# Altium schematic sheet 19 PCIE BRIDGE.SchDoc
size 594 x 420 mm
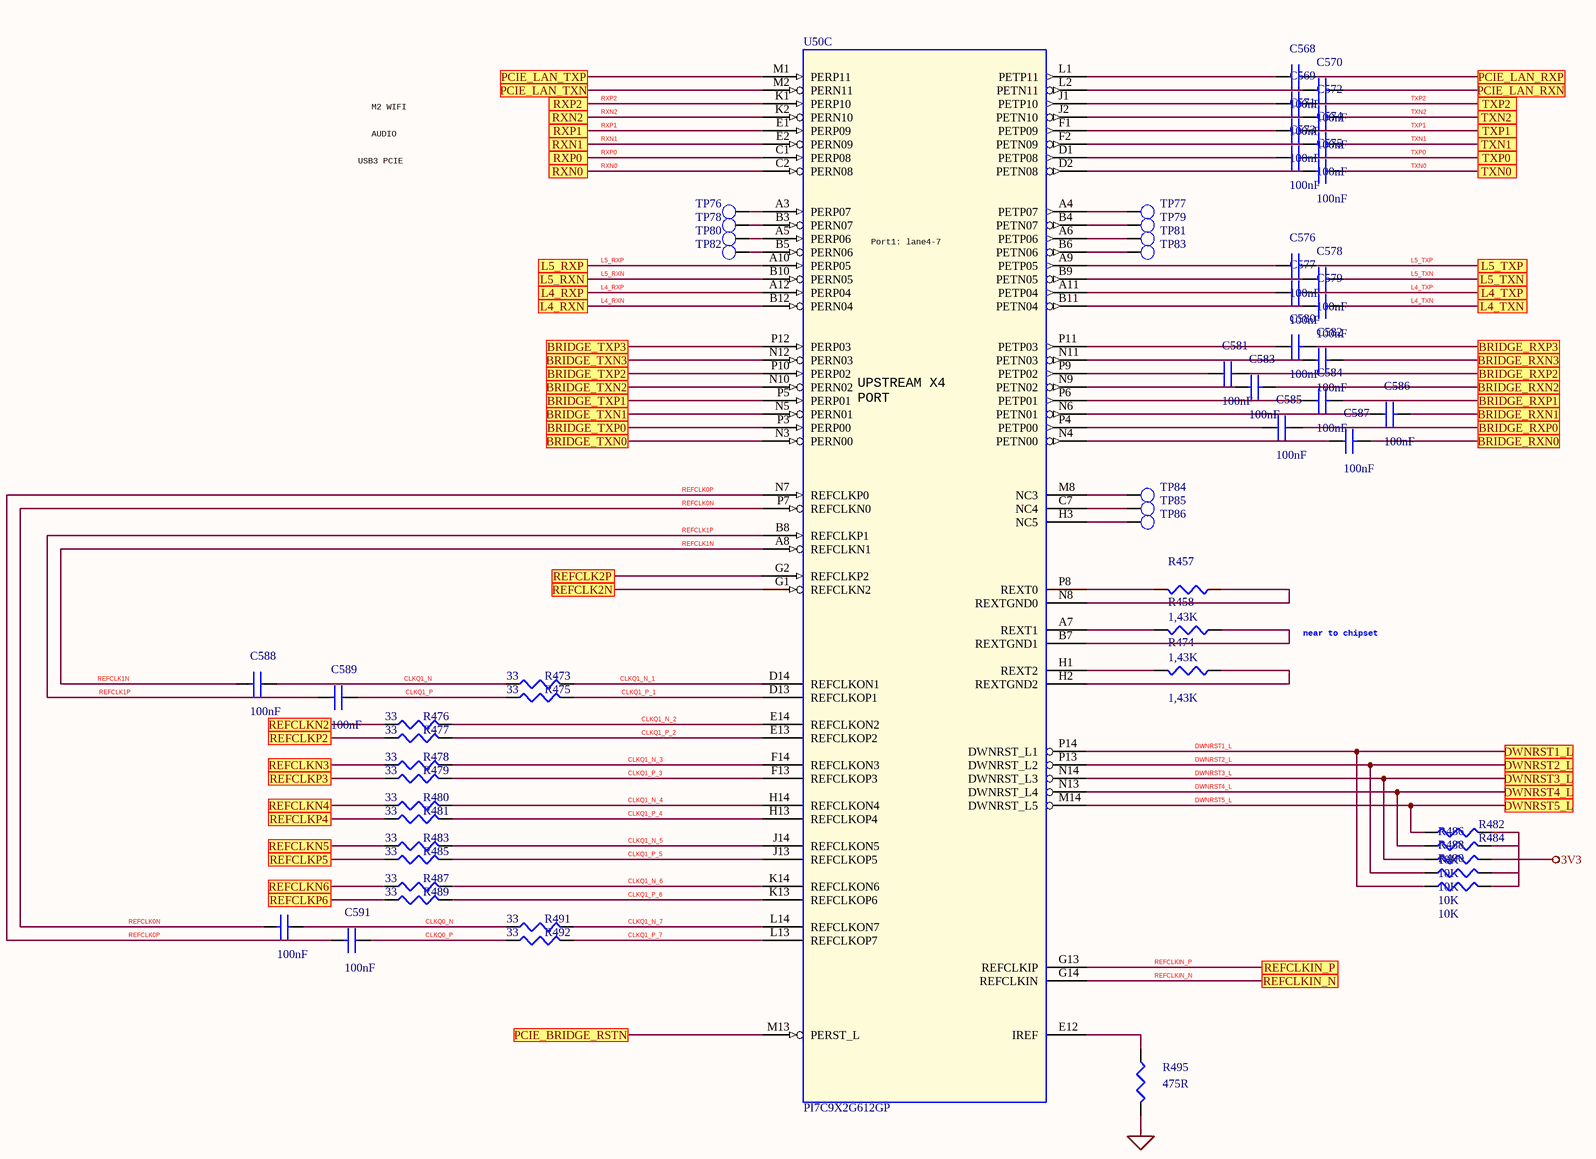
[diagram p0: 19 PCIE BRIDGE.SchDoc, top left]
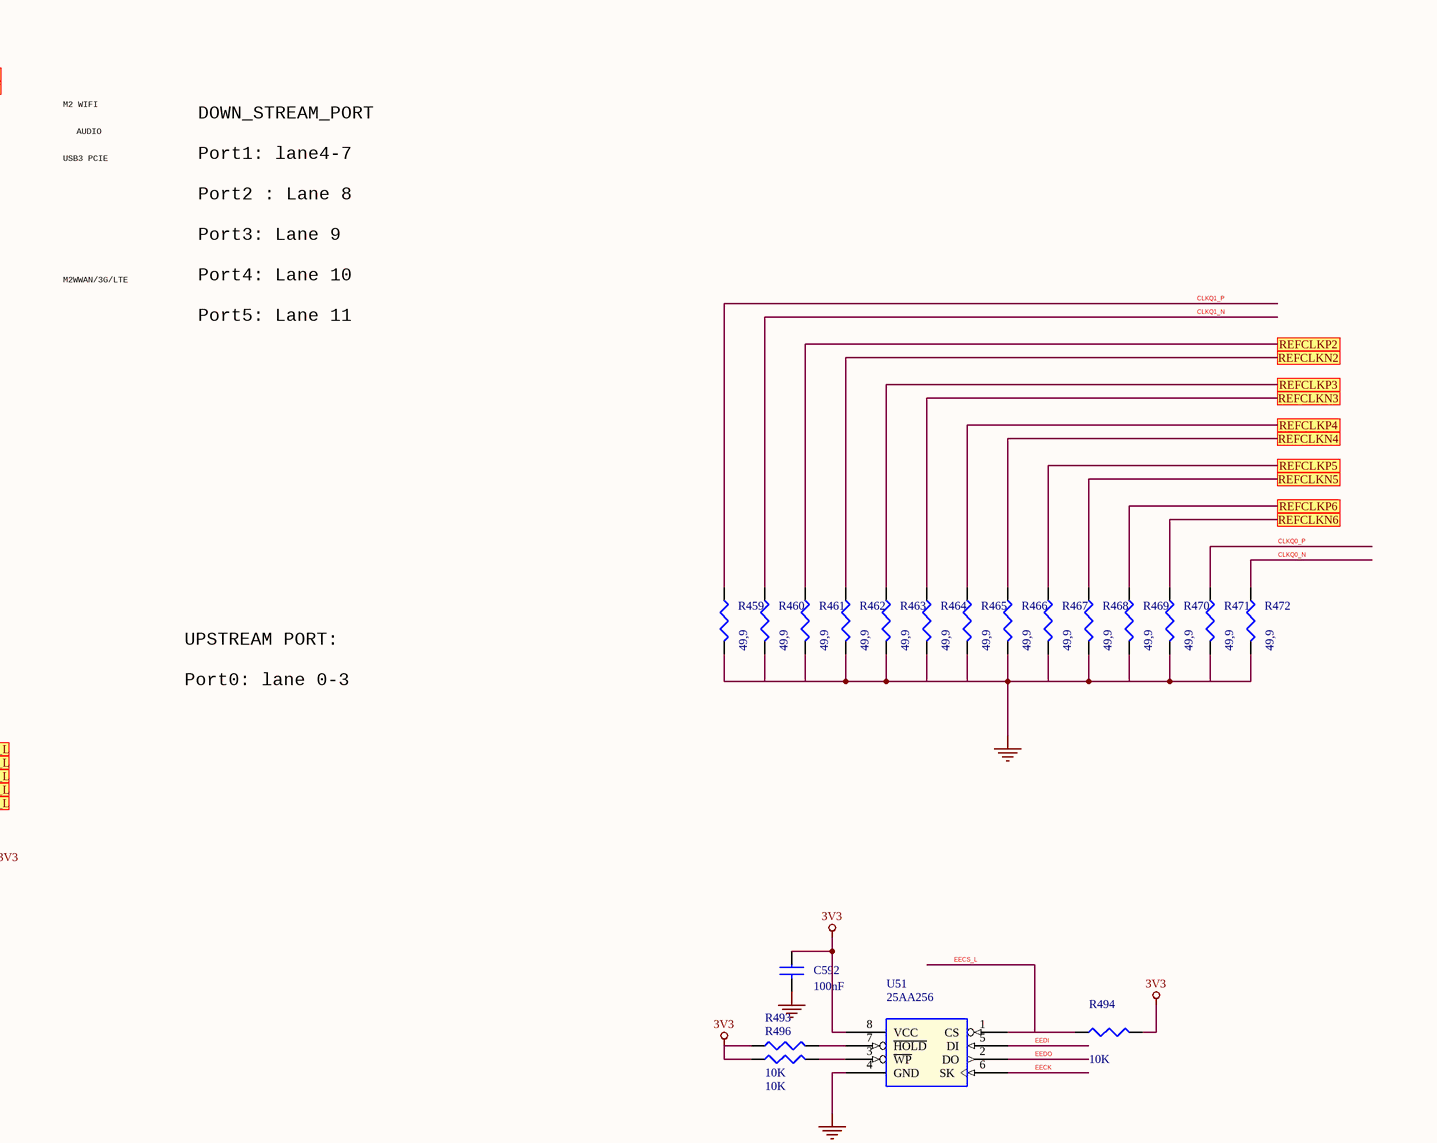
[diagram p1: 19 PCIE BRIDGE.SchDoc, top right]
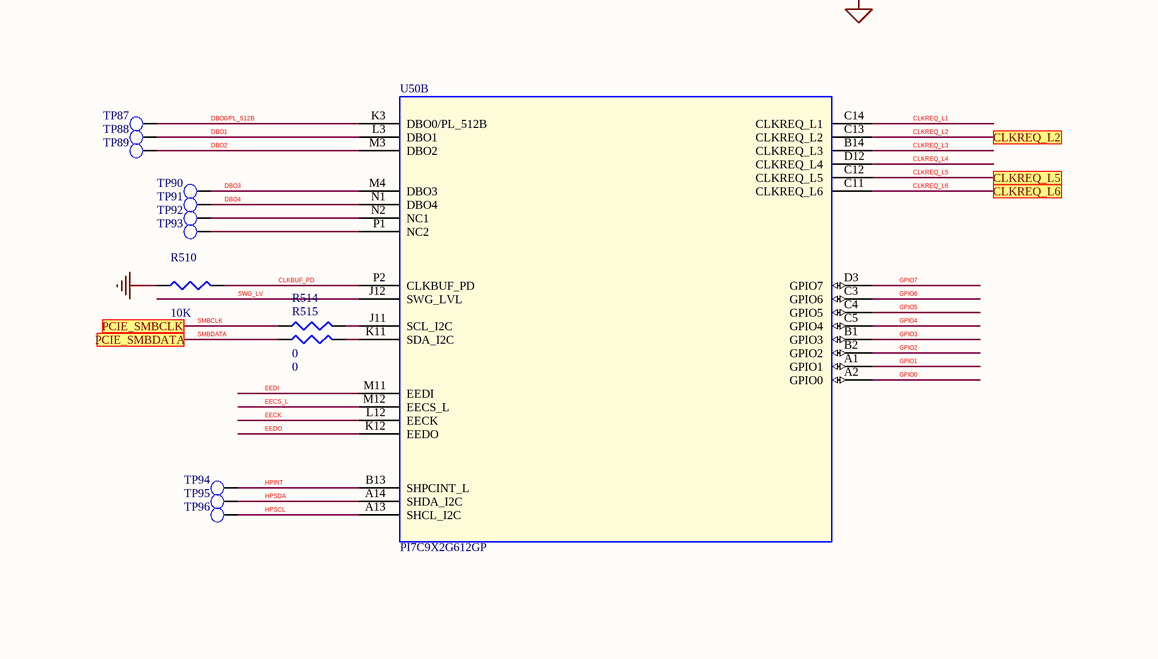
[diagram p2: 19 PCIE BRIDGE.SchDoc, bottom left]
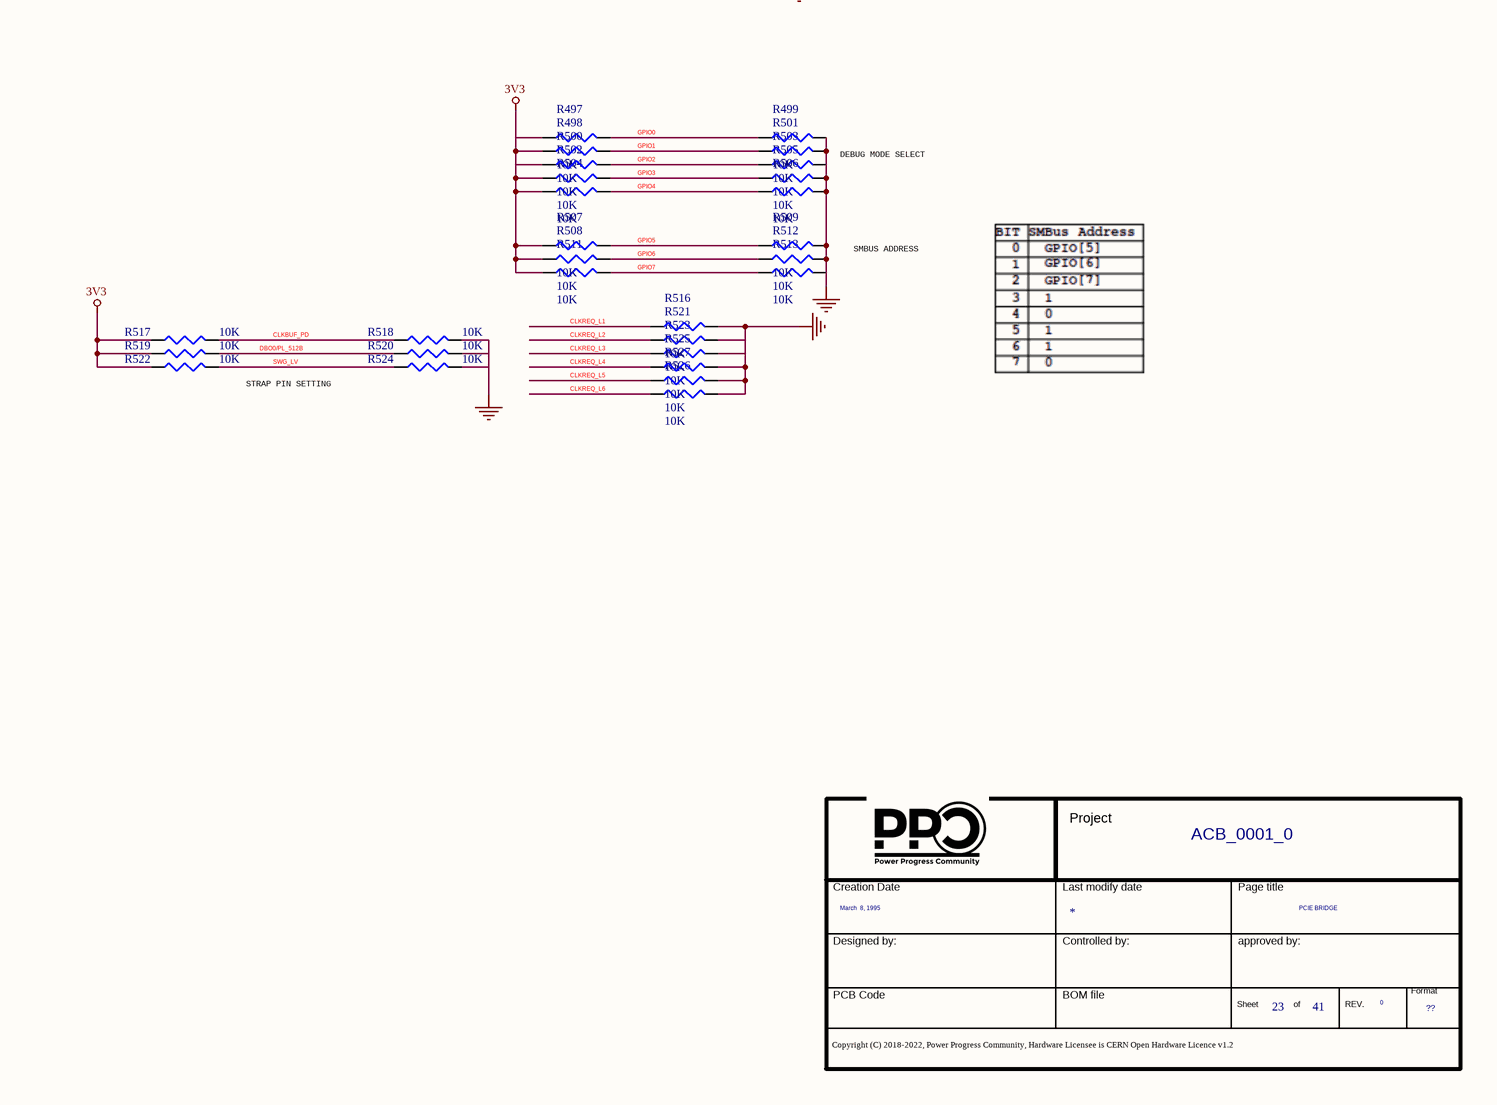
[diagram p3: 19 PCIE BRIDGE.SchDoc, bottom right]

## Parts
*  Page Count: 41  Page Create Date: March  8, 1995  Page Number: 23  Page Size: ??  Page Title: PCIE BRIDGE  RevCode: 0  Title: ACB_0001_0  (hidden comment: Title_block_PPC)  (graphical)
C568  100nF  [SMD_0402]
C569  100nF  [SMD_0402]
C570  100nF  [SMD_0402]
C571  100nF  [SMD_0402]
C572  100nF  [SMD_0402]
C573  100nF  [SMD_0402]
C574  100nF  [SMD_0402]
C575  100nF  [SMD_0402]
C576  100nF  [SMD_0402]
C577  100nF  [SMD_0402]
C578  100nF  [SMD_0402]
C579  100nF  [SMD_0402]
C580  100nF  [SMD_0201]
C581  100nF  [SMD_0201]
C582  100nF  [SMD_0201]
C583  100nF  [SMD_0201]
C584  100nF  [SMD_0201]
C585  100nF  [SMD_0201]
C586  100nF  [SMD_0201]
C587  100nF  [SMD_0201]
C588  100nF  [SMD_0603]
C589  100nF  [SMD_0603]
C590  100nF  [SMD_0402]
C591  100nF  [SMD_0402]
C592  100nF  [SMD_0201]
R457  1,43K  [SMD_0402]
R458  1,43K  [SMD_0402]
R459  49,9  [SMD_0402]
R460  49,9  [SMD_0402]
R461  49,9  [SMD_0402]
R462  49,9  [SMD_0402]
R463  49,9  [SMD_0402]
R464  49,9  [SMD_0402]
R465  49,9  [SMD_0402]
R466  49,9  [SMD_0402]
R467  49,9  [SMD_0402]
R468  49,9  [SMD_0402]
R469  49,9  [SMD_0402]
R470  49,9  [SMD_0402]
R471  49,9  [SMD_0402]
R472  49,9  [SMD_0402]
R473  33  [SMD_0402]
R474  1,43K  [SMD_0402]
R475  33  [SMD_0402]
R476  33  [SMD_0402]
R477  33  [SMD_0402]
R478  33  [SMD_0402]
R479  33  [SMD_0402]
R480  33  [SMD_0402]
R481  33  [SMD_0402]
R482  10K  [SMD_0402]
R483  33  [SMD_0402]
R484  10K  [SMD_0402]
R485  33  [SMD_0402]
R486  10K  [SMD_0402]
R487  33  [SMD_0402]
R488  10K  [SMD_0402]
R489  33  [SMD_0402]
R490  10K  [SMD_0402]
R491  33  [SMD_0402]
R492  33  [SMD_0402]
R493  10K  [SMD_0402]
R494  10K  [SMD_0402]
R495  475R  [SMD_0402]
R496  10K  [SMD_0402]
R497  10K  [SMD_0402]
R498  10K  [SMD_0402]
R499  10K  [SMD_0402]
R500  10K  [SMD_0402]
R501  10K  [SMD_0402]
R502  10K  [SMD_0402]
R503  10K  [SMD_0402]
R504  10K  [SMD_0402]
R505  10K  [SMD_0402]
R506  10K  [SMD_0402]
R507  10K  [SMD_0402]
R508  10K  [SMD_0402]
R509  10K  [SMD_0402]
R510  10K  [SMD_0402]
R511  10K  [SMD_0402]
R512  10K  [SMD_0402]
R513  10K  [SMD_0402]
R514  0  [SMD_0402]
R515  0  [SMD_0402]
R516  10K  [SMD_0402]
R517  10K  [SMD_0402]
R518  10K  [SMD_0402]
R519  10K  [SMD_0402]
R520  10K  [SMD_0402]
R521  10K  [SMD_0402]
R522  10K  [SMD_0402]
R523  10K  [SMD_0402]
R524  10K  [SMD_0402]
R525  10K  [SMD_0402]
R526  10K  [SMD_0402]
R527  10K  [SMD_0402]
TP76  TEST POINT  [PCB]  (value not drawn)
TP77  TEST POINT  [PCB]  (value not drawn)
TP78  TEST POINT  [PCB]  (value not drawn)
TP79  TEST POINT  [PCB]  (value not drawn)
TP80  TEST POINT  [PCB]  (value not drawn)
TP81  TEST POINT  [PCB]  (value not drawn)
TP82  TEST POINT  [PCB]  (value not drawn)
TP83  TEST POINT  [PCB]  (value not drawn)
TP84  TEST POINT  [PCB]  (value not drawn)
TP85  TEST POINT  [PCB]  (value not drawn)
TP86  TEST POINT  [PCB]  (value not drawn)
TP87  TEST POINT  [PCB]  (value not drawn)
TP88  TEST POINT  [PCB]  (value not drawn)
TP89  TEST POINT  [PCB]  (value not drawn)
TP90  TEST POINT  [PCB]  (value not drawn)
TP91  TEST POINT  [PCB]  (value not drawn)
TP92  TEST POINT  [PCB]  (value not drawn)
TP93  TEST POINT  [PCB]  (value not drawn)
TP94  TEST POINT  [PCB]  (value not drawn)
TP95  TEST POINT  [PCB]  (value not drawn)
TP96  TEST POINT  [PCB]  (value not drawn)
U50  PI7C9X2G612GP  [LQFP]  (parts B,C of 3)
U51  25AA256  [SOIC8]

## Ports
BRIDGE_RXN0, BRIDGE_RXN1, BRIDGE_RXN2, BRIDGE_RXN3, BRIDGE_RXP0, BRIDGE_RXP1, BRIDGE_RXP2, BRIDGE_RXP3, BRIDGE_TXN0, BRIDGE_TXN1, BRIDGE_TXN2, BRIDGE_TXN3, BRIDGE_TXP0, BRIDGE_TXP1, BRIDGE_TXP2, BRIDGE_TXP3, CLKREQ_L2, CLKREQ_L5, CLKREQ_L6, DWNRST1_L, DWNRST2_L, DWNRST3_L, DWNRST4_L, DWNRST5_L, L4_RXN, L4_RXP, L4_TXN, L4_TXP, L5_RXN, L5_RXP, L5_TXN, L5_TXP, PCIE_BRIDGE_RSTN, PCIE_LAN_RXN, PCIE_LAN_RXP, PCIE_LAN_TXN, PCIE_LAN_TXP, PCIE_SMBCLK, PCIE_SMBDATA, REFCLK2N, REFCLK2P, REFCLKIN_N, REFCLKIN_P, REFCLKN2, REFCLKN3, REFCLKN4, REFCLKN5, REFCLKN6, REFCLKP2, REFCLKP3, REFCLKP4, REFCLKP5, REFCLKP6, RXN0, RXN1, RXN2, RXP0, RXP1, RXP2, TXN0, TXN1, TXN2, TXP0, TXP1, TXP2

## Nets
3V3: C592.1 R482.2 R484.2 R486.2 R488.2 R490.2 R493.1 R494.2 R496.1 R497.1 R498.1 R500.1 R502.1 R504.1 R507.1 R508.1 R511.1 R517.1 R519.1 R522.1 U51.8(VCC)
GND: C592.2 R459.2 R460.2 R461.2 R462.2 R463.2 R464.2 R465.2 R466.2 R467.2 R468.2 R469.2 R470.2 R471.2 R472.2 R495.2 R499.2 R501.2 R503.2 R505.2 R506.2 R509.2 R510.2 R512.2 R513.2 R516.2 R518.2 R520.2 R521.2 R523.2 R524.2 R525.2 R526.2 R527.2 U51.4(GND)
BRIDGE_RXN0: C587.2 ; port BRIDGE_RXN0
BRIDGE_RXN1: C586.2 ; port BRIDGE_RXN1
BRIDGE_RXN2: C583.2 ; port BRIDGE_RXN2
BRIDGE_RXN3: C582.2 ; port BRIDGE_RXN3
BRIDGE_RXP0: C585.2 ; port BRIDGE_RXP0
BRIDGE_RXP1: C584.2 ; port BRIDGE_RXP1
BRIDGE_RXP2: C581.2 ; port BRIDGE_RXP2
BRIDGE_RXP3: C580.2 ; port BRIDGE_RXP3
BRIDGE_TXN0: U50.N3(PERN00) ; port BRIDGE_TXN0
BRIDGE_TXN1: U50.N5(PERN01) ; port BRIDGE_TXN1
BRIDGE_TXN2: U50.N10(PERN02) ; port BRIDGE_TXN2
BRIDGE_TXN3: U50.N12(PERN03) ; port BRIDGE_TXN3
BRIDGE_TXP0: U50.P3(PERP00) ; port BRIDGE_TXP0
BRIDGE_TXP1: U50.P5(PERP01) ; port BRIDGE_TXP1
BRIDGE_TXP2: U50.P10(PERP02) ; port BRIDGE_TXP2
BRIDGE_TXP3: U50.P12(PERP03) ; port BRIDGE_TXP3
CLKBUF_PD: R510.1 R517.2 R518.1 U50.P2(CLKBUF_PD)
CLKQ0_N: C590.1 R472.1 R491.2
CLKQ0_P: C591.1 R471.1 R492.2
CLKQ1_N: C588.1 R460.1 R473.2
CLKQ1_N_1: R473.1 U50.D14(REFCLKON1)
CLKQ1_N_2: R476.1 U50.E14(REFCLKON2)
CLKQ1_N_3: R478.1 U50.F14(REFCLKON3)
CLKQ1_N_4: R480.1 U50.H14(REFCLKON4)
CLKQ1_N_5: R483.1 U50.J14(REFCLKON5)
CLKQ1_N_6: R487.1 U50.K14(REFCLKON6)
CLKQ1_N_7: R491.1 U50.L14(REFCLKON7)
CLKQ1_P: C589.1 R459.1 R475.2
CLKQ1_P_1: R475.1 U50.D13(REFCLKOP1)
CLKQ1_P_2: R477.1 U50.E13(REFCLKOP2)
CLKQ1_P_3: R479.1 U50.F13(REFCLKOP3)
CLKQ1_P_4: R481.1 U50.H13(REFCLKOP4)
CLKQ1_P_5: R485.1 U50.J13(REFCLKOP5)
CLKQ1_P_6: R489.1 U50.K13(REFCLKOP6)
CLKQ1_P_7: R492.1 U50.L13(REFCLKOP7)
CLKREQ_L1: R516.1 U50.C14(CLKREQ_L1)
CLKREQ_L2: R521.1 U50.C13(CLKREQ_L2) ; port CLKREQ_L2
CLKREQ_L3: R523.1 U50.B14(CLKREQ_L3)
CLKREQ_L4: R525.1 U50.D12(CLKREQ_L4)
CLKREQ_L5: R527.1 U50.C12(CLKREQ_L5) ; port CLKREQ_L5
CLKREQ_L6: R526.1 U50.C11(CLKREQ_L6) ; port CLKREQ_L6
DBO0/PL_512B: R519.2 R520.1 TP87.1(TP) U50.K3(DBO0/PL_512B)
DBO1: TP88.1(TP) U50.L3(DBO1)
DBO2: TP89.1(TP) U50.M3(DBO2)
DBO3: TP90.1(TP) U50.M4(DBO3)
DBO4: TP91.1(TP) U50.N1(DBO4)
DWNRST1_L: R490.1 U50.P14(DWNRST_L1) ; port DWNRST1_L
DWNRST2_L: R488.1 U50.P13(DWNRST_L2) ; port DWNRST2_L
DWNRST3_L: R486.1 U50.N14(DWNRST_L3) ; port DWNRST3_L
DWNRST4_L: R484.1 U50.N13(DWNRST_L4) ; port DWNRST4_L
DWNRST5_L: R482.1 U50.M14(DWNRST_L5) ; port DWNRST5_L
EECK: U50.L12(EECK) U51.6(SK)
EECS_L: R494.1 U50.M12(EECS_L) U51.1(CS)
EEDI: U50.M11(EEDI) U51.5(DI)
EEDO: U50.K12(EEDO) U51.2(DO)
GPIO0: R497.2 R499.1 U50.A2(GPIO0)
GPIO1: R498.2 R501.1 U50.A1(GPIO1)
GPIO2: R500.2 R503.1 U50.B2(GPIO2)
GPIO3: R502.2 R505.1 U50.B1(GPIO3)
GPIO4: R504.2 R506.1 U50.C5(GPIO4)
GPIO5: R507.2 R509.1 U50.C4(GPIO5)
GPIO6: R508.2 R512.1 U50.C3(GPIO6)
GPIO7: R511.2 R513.1 U50.D3(GPIO7)
HPINT: TP94.1(TP) U50.B13(SHPCINT_L)
HPSCL: TP96.1(TP) U50.A13(SHCL_I2C)
HPSDA: TP95.1(TP) U50.A14(SHDA_I2C)
L4_RXN: U50.B12(PERN04) ; port L4_RXN
L4_RXP: U50.A12(PERP04) ; port L4_RXP
L4_TXN: C579.2 ; port L4_TXN
L4_TXP: C577.2 ; port L4_TXP
L5_RXN: U50.B10(PERN05) ; port L5_RXN
L5_RXP: U50.A10(PERP05) ; port L5_RXP
L5_TXN: C578.2 ; port L5_TXN
L5_TXP: C576.2 ; port L5_TXP
PCIE_BRIDGE_RSTN: U50.M13(PERST_L) ; port PCIE_BRIDGE_RSTN
PCIE_LAN_RXN: C570.2 ; port PCIE_LAN_RXN
PCIE_LAN_RXP: C568.2 ; port PCIE_LAN_RXP
PCIE_LAN_TXN: U50.M2(PERN11) ; port PCIE_LAN_TXN
PCIE_LAN_TXP: U50.M1(PERP11) ; port PCIE_LAN_TXP
REFCLK0N: C590.2 U50.P7(REFCLKN0)
REFCLK0P: C591.2 U50.N7(REFCLKP0)
REFCLK1N: C588.2 U50.A8(REFCLKN1)
REFCLK1P: C589.2 U50.B8(REFCLKP1)
REFCLK2N: U50.G1(REFCLKN2) ; port REFCLK2N
REFCLK2P: U50.G2(REFCLKP2) ; port REFCLK2P
REFCLKIN_N: U50.G14(REFCLKIN) ; port REFCLKIN_N
REFCLKIN_P: U50.G13(REFCLKIP) ; port REFCLKIN_P
REFCLKN2: R462.1 R476.2 ; port REFCLKN2
REFCLKN3: R464.1 R478.2 ; port REFCLKN3
REFCLKN4: R466.1 R480.2 ; port REFCLKN4
REFCLKN5: R468.1 R483.2 ; port REFCLKN5
REFCLKN6: R470.1 R487.2 ; port REFCLKN6
REFCLKP2: R461.1 R477.2 ; port REFCLKP2
REFCLKP3: R463.1 R479.2 ; port REFCLKP3
REFCLKP4: R465.1 R481.2 ; port REFCLKP4
REFCLKP5: R467.1 R485.2 ; port REFCLKP5
REFCLKP6: R469.1 R489.2 ; port REFCLKP6
RXN0: U50.C2(PERN08) ; port RXN0
RXN1: U50.E2(PERN09) ; port RXN1
RXN2: U50.K2(PERN10) ; port RXN2
RXP0: U50.C1(PERP08) ; port RXP0
RXP1: U50.E1(PERP09) ; port RXP1
RXP2: U50.K1(PERP10) ; port RXP2
SMBCLK: R514.1 ; port PCIE_SMBCLK
SMBDATA: R515.1 ; port PCIE_SMBDATA
SWG_LV: R522.2 R524.1 U50.J12(SWG_LVL)
TXN0: C575.2 ; port TXN0
TXN1: C574.2 ; port TXN1
TXN2: C572.2 ; port TXN2
TXP0: C573.2 ; port TXP0
TXP1: C571.2 ; port TXP1
TXP2: C569.2 ; port TXP2
NetC568_1: C568.1 U50.L1(PETP11)
NetC569_1: C569.1 U50.J1(PETP10)
NetC570_1: C570.1 U50.L2(PETN11)
NetC571_1: C571.1 U50.F1(PETP09)
NetC572_1: C572.1 U50.J2(PETN10)
NetC573_1: C573.1 U50.D1(PETP08)
NetC574_1: C574.1 U50.F2(PETN09)
NetC575_1: C575.1 U50.D2(PETN08)
NetC576_1: C576.1 U50.A9(PETP05)
NetC577_1: C577.1 U50.A11(PETP04)
NetC578_1: C578.1 U50.B9(PETN05)
NetC579_1: C579.1 U50.B11(PETN04)
NetC580_1: C580.1 U50.P11(PETP03)
NetC581_1: C581.1 U50.P9(PETP02)
NetC582_1: C582.1 U50.N11(PETN03)
NetC583_1: C583.1 U50.N9(PETN02)
NetC584_1: C584.1 U50.P6(PETP01)
NetC585_1: C585.1 U50.P4(PETP00)
NetC586_1: C586.1 U50.N6(PETN01)
NetC587_1: C587.1 U50.N4(PETN00)
NetR457_1: R457.1 U50.P8(REXT0)
NetR457_2: R457.2 U50.N8(REXTGND0)
NetR458_1: R458.1 U50.A7(REXT1)
NetR458_2: R458.2 U50.B7(REXTGND1)
NetR474_1: R474.1 U50.H1(REXT2)
NetR474_2: R474.2 U50.H2(REXTGND2)
NetR493_2: R493.2 U51.7(~{HOLD})
NetR495_1: R495.1 U50.E12(IREF)
NetR496_2: R496.2 U51.3(~{WP})
NetR514_2: R514.2 U50.J11(SCL_I2C)
NetR515_2: R515.2 U50.K11(SDA_I2C)
NetTP76_1: TP76.1(TP) U50.A3(PERP07)
NetTP77_1: TP77.1(TP) U50.A4(PETP07)
NetTP78_1: TP78.1(TP) U50.B3(PERN07)
NetTP79_1: TP79.1(TP) U50.B4(PETN07)
NetTP80_1: TP80.1(TP) U50.A5(PERP06)
NetTP81_1: TP81.1(TP) U50.A6(PETP06)
NetTP82_1: TP82.1(TP) U50.B5(PERN06)
NetTP83_1: TP83.1(TP) U50.B6(PETN06)
NetTP84_1: TP84.1(TP) U50.M8(NC3)
NetTP85_1: TP85.1(TP) U50.C7(NC4)
NetTP86_1: TP86.1(TP) U50.H3(NC5)
NetTP92_1: TP92.1(TP) U50.N2(NC1)
NetTP93_1: TP93.1(TP) U50.P1(NC2)

## Notes on the sheet
- AUDIO
- M2 WIFI
- DOWN_STREAM_PORT
  Port1: lane4-7
  Port2 : Lane 8
  Port3: Lane 9
  Port4: Lane 10
  Port5: Lane 11
- USB3 PCIE
- (near U50) Port1: lane4-7
- M2WWAN/3G/LTE
- (near U50) UPSTREAM X4
  PORT
- UPSTREAM PORT:
  Port0: lane 0-3
- near to chipset
- DEBUG MODE SELECT
- SMBUS ADDRESS
- STRAP PIN SETTING
- (in symbol Title_block_PPC) Project; Creation Date; Last modify date; Page title; Designed by:; Controlled by:; approved by:; Format; PCB Code; BOM file; Sheet; of; REV.; Copyright (C) 2018-2022, Power Progress Community, Hardware Licensee is CERN Open Hardware Licence v1.2

## Library data of the parts
C568-C579 = CAP NP_Dup3: COND.CER. 100NF 50V 0402 X7R SMD; Manufacturer Part Number 1: CGA2B3X7R1H104M050BD; Manufacturer 1: TDK; Part Number: PASSIVE_24; RSM: RC0402; PCB Footprint: SMD_0402; Part Type: Capacitors\Ceramic\SMD\0402
C580-C587 C592 = CAP NP_Dup3: CAP CER 0.1UF 6.3V 20% X5R 0201; Part Number: PASSIVE_3; Manufacturer 1: TDK; Manufacturer Part Number 1: C0603X5R0J104M030BC; RSM: RC0201; Part Type: Capacitors\Ceramic\SMD\0201; PCB Footprint: SMD_0201
C588 C589 = CAP NP_Dup3: COND.CER.100NF 50V 0603 X7R SMD; Part Number: PASSIVE_118; Manufacturer 1: PANASONIC; Manufacturer Part Number 1: ECJ1VB1H104K; RSM: RC0603; Part Type: Capacitors\Ceramic\SMD\0603; PCB Footprint: SMD_0603
C590 C591 = CAP NP_Dup3: COND.CER. 100NF 50V 0402 X7R SMD; Part Number: PASSIVE_24; Manufacturer 1: TDK; Manufacturer Part Number 1: CGA2B3X7R1H104M050BD; RSM: RC0402; Part Type: Capacitors\Ceramic\SMD\0402; PCB Footprint: SMD_0402
R457 R458 R474 = R_Dup6: RESIS.CHIP 1,43K 1% 0402 SMD; Part Number: PASSIVE_1462; Manufacturer 1: ROYAL OHM; RSM: RC0402; Part Type: Resistors\Fixed\SMD\0402\1%; PCB Footprint: SMD_0402; Manufacturer Part Number 1: RESIS.CHIP 1,43K 1% 0402 SMD
R459-R470 = R_Dup6: RESIS.CHIP 49,9R 1% 0402 SMD; Part Number: PASSIVE_738; Manufacturer 1: NIC; Manufacturer Part Number 1: NCR04F49R9TRF; RSM: RC0402; PCB Footprint: SMD_0402; Part Type: Resistors\Fixed\SMD\0402\1%; Distributor 1: MODULI ELETTRONICI E COMPONENTI spa
R471 R472 = R_Dup6: RESIS.CHIP 49,9R 1% 0402 SMD; Manufacturer Part Number 1: NCR04F49R9TRF; Manufacturer 1: NIC; Part Number: PASSIVE_738; RSM: RC0402; PCB Footprint: SMD_0402; Distributor 1: MODULI ELETTRONICI E COMPONENTI spa; Part Type: Resistors\Fixed\SMD\0402\1%
R473 R476 R477 R479 R481 R485 R489 R492 = R_Dup6: RESIS.CHIP 33R 5% 0402 SMD; Manufacturer 1: ROYAL OHM; Part Number: PASSIVE_853; RSM: RC0402; PCB Footprint: SMD_0402; Distributor 1: CAMEL ELETTRONICA SRL  #; Manufacturer Part Number 1: RESIS.CHIP 33R 5% 0402 SMD; Part Type: Resistors\Fixed\SMD\0402\5%
R475 R478 R480 R483 R487 R491 = R_Dup6: RESIS.CHIP 33R 5% 0402 SMD; Part Number: PASSIVE_853; Manufacturer 1: ROYAL OHM; RSM: RC0402; PCB Footprint: SMD_0402; Part Type: Resistors\Fixed\SMD\0402\5%; Manufacturer Part Number 1: RESIS.CHIP 33R 5% 0402 SMD; Distributor 1: CAMEL ELETTRONICA SRL  #
R482 R484 = R_Dup6: RESIS.CHIP 10K 1% 0402 SMD; Part Number: PASSIVE_584; Manufacturer 1: ROYAL OHM; RSM: RC0402; PCB Footprint: SMD_0402; Part Type: Resistors\Fixed\SMD\0402\1%; Manufacturer Part Number 1: RESIS.CHIP 10K 1% 0402 SMD
R486 R488 R490 R493 R494 R496-R513 R516-R527 = R_Dup6: RESIS.CHIP 10K 1% 0402 SMD; Manufacturer 1: ROYAL OHM; Part Number: PASSIVE_584; RSM: RC0402; Manufacturer Part Number 1: RESIS.CHIP 10K 1% 0402 SMD; PCB Footprint: SMD_0402; Part Type: Resistors\Fixed\SMD\0402\1%
R495 = R_Dup6: RESIS.CHIP 475R 1% 0402 SMD; Part Number: PASSIVE_736; Manufacturer 1: PANASONIC ECG; Manufacturer Part Number 1: ERJ-2RKF4750X ( COMP.); RSM: RC0402; Part Type: Resistors\Fixed\SMD\0402\1%; PCB Footprint: SMD_0402
R514 = R_Dup6: RESIS.CHIP 0R 5% 0402 SMD; Part Number: PASSIVE_805; Manufacturer 1: ROYAL OHM; RSM: RC0402; Part Type: Resistors\Fixed\SMD\0402\5%; PCB Footprint: SMD_0402; Manufacturer Part Number 1: RESIS.CHIP 0R 5% 0402 SMD
R515 = R_Dup6: RESIS.CHIP 0R 5% 0402 SMD; Part Number: PASSIVE_805; Manufacturer 1: ROYAL OHM; RSM: RC1206; Part Type: Resistors\Fixed\SMD\0402\5%; PCB Footprint: SMD_0402; Manufacturer Part Number 1: RESIS.CHIP 0R 5% 0402 SMD
TP76-TP96 = T POINT R: TEST POINT SU PCB; Part Number: CONNECTORS_542; RSM: AE-TESTPOINT; PCB Footprint: PCB; Part Type: Tpoint
U50 = PI7C9X2G612GP: PCI 6 Ports 6Lanes PCIE2 Packet Switch; Part Number: LOGIC_342; Manufacturer 1: DIODES; Manufacturer Part Number 1: PI7C9X2G612GPCNJE; PCB Footprint: LBGA_196; RSM: LGA-196-15_15; Part Type: PCIE\SWITCH; Distributor 1: MOUSER( 729-PI7C9X2G612GPCNJ )
U51 = SPI_EEPROM_1: IC SPI EEPROM 256KBIT 10MHZ 8SOIC; Manufacturer Part Number 1: 25AA256-I/SN; Manufacturer 1: MICROCHIP; Part Number: MEMORIES_11; RSM: SO-8; PCB Footprint: SOIC8; Distributor 1: DIGIKEY (25AA256-I/SN-ND); Part Type: EEPROM
* = Title_block_PPC: Page Modify Date: *